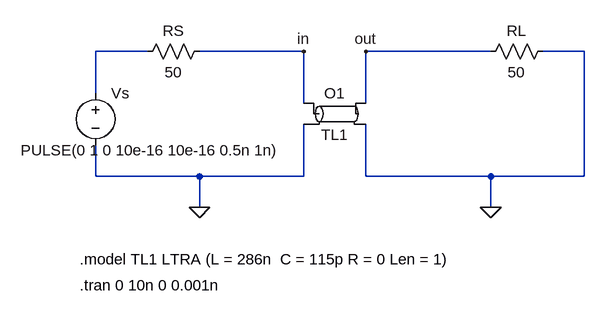
[diagram p0: schematic exercise2_lossfreeTL.asc]
exercise2_lossfreeTL.asc, the LTspice schematic file:
Version 4
SHEET 1 880 680
WIRE -80 0 -160 0
WIRE 160 0 0 0
WIRE 448 0 256 0
WIRE 592 0 528 0
WIRE -160 64 -160 0
WIRE 160 80 160 0
WIRE 256 80 256 0
WIRE -160 192 -160 144
WIRE 0 192 -160 192
WIRE 160 192 160 112
WIRE 160 192 0 192
WIRE 256 192 256 112
WIRE 448 192 256 192
WIRE 592 192 592 0
WIRE 592 192 448 192
WIRE 0 240 0 192
WIRE 448 240 448 192
FLAG 448 240 0
FLAG 0 240 0
FLAG 256 0 out
FLAG 160 0 in
SYMBOL ltline 208 96 R0
SYMATTR InstName O1
SYMATTR Value TL1
SYMBOL res 544 -16 R90
WINDOW 0 0 56 VBottom 2
WINDOW 3 32 56 VTop 2
SYMATTR InstName RL
SYMATTR Value 50
SYMBOL res 16 -16 R90
WINDOW 0 0 56 VBottom 2
WINDOW 3 32 56 VTop 2
SYMATTR InstName RS
SYMATTR Value 50
SYMBOL voltage -160 48 R0
WINDOW 3 -115 104 Left 2
WINDOW 123 0 0 Left 0
WINDOW 39 0 0 Left 0
SYMATTR Value PULSE(0 1 0 10e-16 10e-16 0.5n 1n)
SYMATTR InstName Vs
TEXT -184 320 Left 2 !.model TL1 LTRA (L = 286n  C = 115p R = 0 Len = 1)
TEXT -184 360 Left 2 !.tran 0 10n 0 0.001n

The netlist it stands for:
* exercise2_lossfreeTL.asc
O1 in 0 out 0 TL1
RL 0 out 50
RS in N001 50
Vs N001 0 PULSE(0 1 0 10e-16 10e-16 0.5n 1n)
.model TL1 LTRA (L = 286n  C = 115p R = 0 Len = 1)
.tran 0 10n 0 0.001n
.backanno
.end